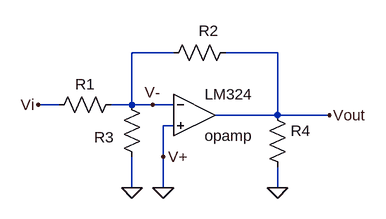
[diagram p0: schematic Draft1.asc]
Draft1.asc, the LTspice schematic file:
Version 4
SHEET 1 880 680
WIRE 256 80 192 80
WIRE 416 80 336 80
WIRE 80 160 48 160
WIRE 192 160 192 80
WIRE 192 160 160 160
WIRE 224 160 192 160
WIRE 256 160 224 160
WIRE 416 176 416 80
WIRE 416 176 320 176
WIRE 496 176 416 176
WIRE 256 192 240 192
WIRE 240 240 240 192
WIRE 192 288 192 240
WIRE 240 288 240 240
WIRE 416 288 416 256
FLAG 48 160 Vi
FLAG 496 176 Vout
FLAG 224 160 V-
FLAG 240 240 V+
FLAG 240 288 0
FLAG 192 288 0
FLAG 416 288 0
SYMBOL Opamps\\opamp 288 112 R0
SYMATTR InstName LM324
SYMBOL res 176 144 R90
WINDOW 0 0 56 VBottom 2
WINDOW 3 32 56 VTop 2
SYMATTR InstName R1
SYMATTR Value ""
SYMBOL res 208 256 R180
WINDOW 0 43 46 Left 2
WINDOW 3 36 40 Left 2
SYMATTR InstName R3
SYMATTR Value ""
SYMBOL res 240 96 R270
WINDOW 0 34 70 VTop 2
WINDOW 3 0 56 VBottom 2
SYMATTR InstName R2
SYMATTR Value ""
SYMBOL res 400 160 R0
SYMATTR InstName R4
SYMATTR Value ""

The netlist it stands for:
* Draft1.asc
XLM324 V- 0 Vout opamp Aol=100K GBW=10Meg  ; pins invin noninvin out
R1 V- Vi
R3 0 V-
R2 V- Vout
R4 Vout 0
.backanno
.end